# Altium schematic sheet SLAVE_HW.SchDoc
size A4; DocumentNumber: 1; SheetNumber: 1; SheetTotal: 5
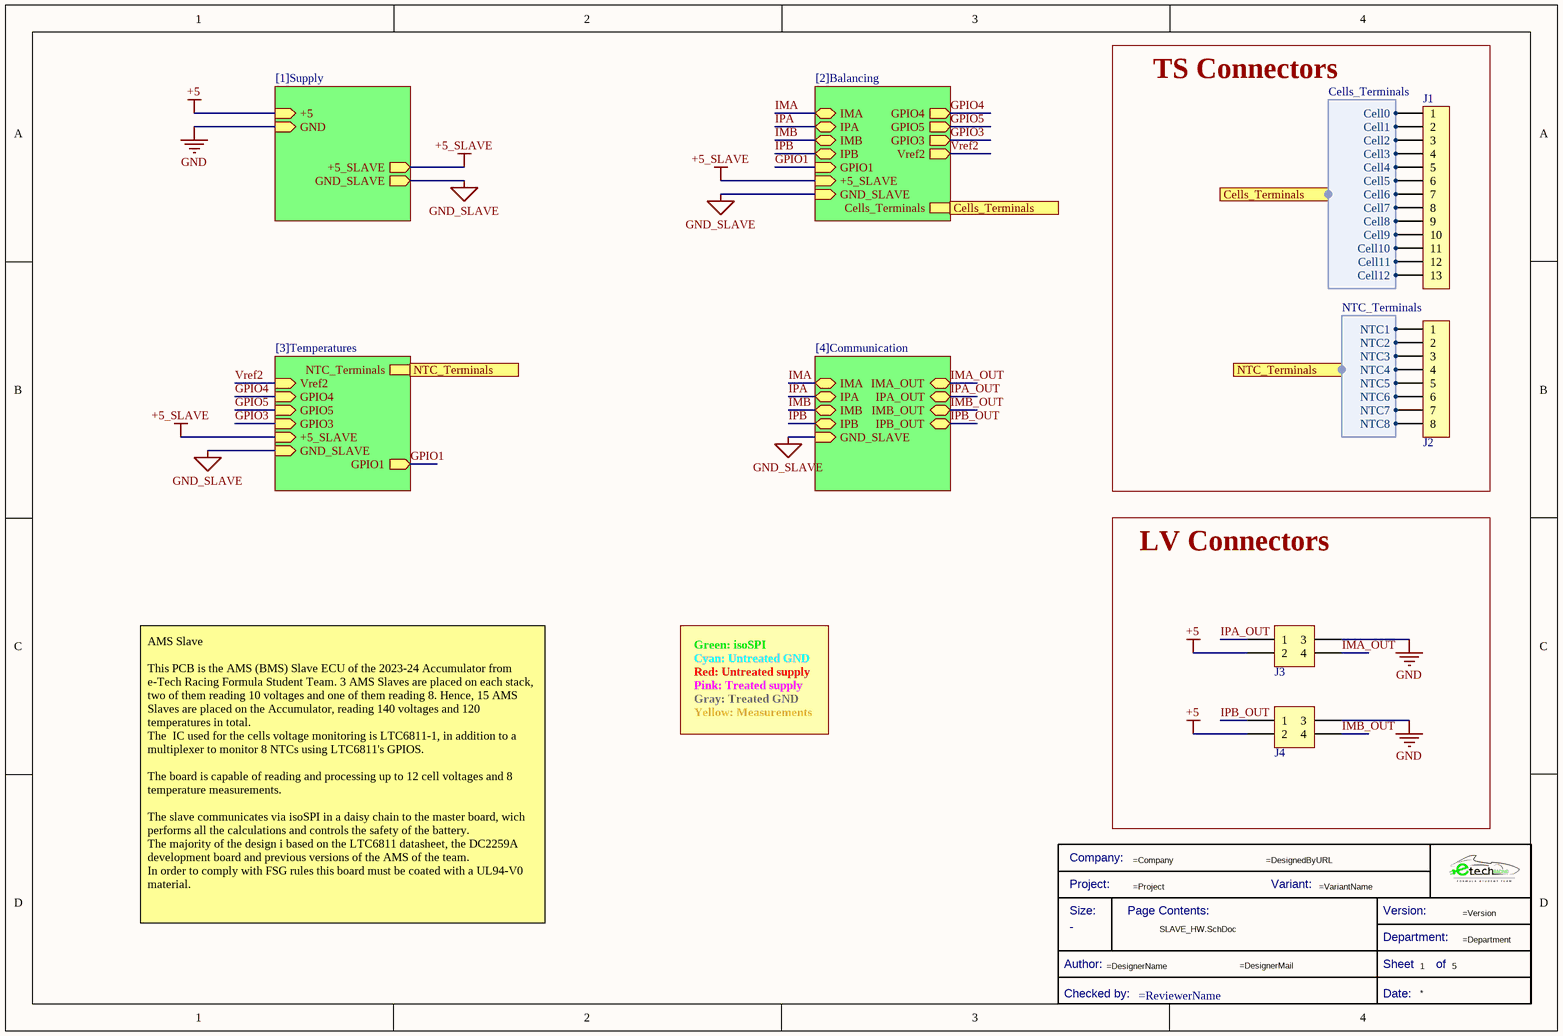
[diagram p0: SLAVE_HW.SchDoc]

## Parts
*  Title Block_template  (value not drawn)  (graphical)
J1  61301311121  [J_Pinheader_1x13]  (value not drawn)
J2  61301211121  [J_Pinheader_1x8]  (value not drawn)
J3  J_NanoFit_2x2  [J_NanoFit_2x2_v]  (value not drawn)
J4  J_NanoFit_2x2  [J_NanoFit_2x2_v]  (value not drawn)

## Blocks framed on the sheet
TS Connectors: J1 J2
LV Connectors: J3 J4

## Sub-sheets
Balancing = [2]Balancing: GPIO4 (out), GPIO5 (out), GPIO1 (in), +5_SLAVE (in), GND_SLAVE (in), IMA (bidir), IPA (bidir), IMB (bidir), IPB (bidir), GPIO3 (out), Vref2 (out), Cells_Terminals (harness Cells_Terminals)
Communication = [4]Communication: IMA_OUT (bidir), IPA_OUT (bidir), IMB_OUT (bidir), IPB_OUT (bidir), IMA (bidir), IPA (bidir), IMB (bidir), IPB (bidir), GND_SLAVE (in)
Supply = [1]Supply: +5 (in), GND (in), +5_SLAVE (out), GND_SLAVE (out)
Temperatures = [3]Temperatures: GPIO4 (in), GPIO5 (in), +5_SLAVE (in), GND_SLAVE (in), GPIO1 (out), GPIO3 (in), Vref2 (in), NTC_Terminals (harness NTC_Terminals)

## Ports
Cells_Terminals (harness Cells_Terminals), NTC_Terminals (harness NTC_Terminals)

## Harnesses
Cells_Terminals: Cell0, Cell1, Cell2, Cell3, Cell4, Cell5, Cell6, Cell7, Cell8, Cell9, Cell10, Cell11, Cell12
NTC_Terminals: NTC1, NTC2, NTC3, NTC4, NTC5, NTC6, NTC7, NTC8

## Nets
+5: J3.2 J4.2 ; sheet Supply/+5
+5_SLAVE: sheet Supply/+5_SLAVE, sheet Balancing/+5_SLAVE, sheet Temperatures/+5_SLAVE
GND: J3.3 J4.3 ; sheet Supply/GND
GND_SLAVE: sheet Supply/GND_SLAVE, sheet Balancing/GND_SLAVE, sheet Temperatures/GND_SLAVE, sheet Communication/GND_SLAVE
GPIO1: sheet Balancing/GPIO1, sheet Temperatures/GPIO1
GPIO3: sheet Balancing/GPIO3, sheet Temperatures/GPIO3
GPIO4: sheet Balancing/GPIO4, sheet Temperatures/GPIO4
GPIO5: sheet Balancing/GPIO5, sheet Temperatures/GPIO5
IMA: sheet Balancing/IMA, sheet Communication/IMA
IMA_OUT: J3.4 ; sheet Communication/IMA_OUT
IMB: sheet Balancing/IMB, sheet Communication/IMB
IMB_OUT: J4.4 ; sheet Communication/IMB_OUT
IPA: sheet Balancing/IPA, sheet Communication/IPA
IPA_OUT: J3.1 ; sheet Communication/IPA_OUT
IPB: sheet Balancing/IPB, sheet Communication/IPB
IPB_OUT: J4.1 ; sheet Communication/IPB_OUT
Vref2: sheet Balancing/Vref2, sheet Temperatures/Vref2
NetJ1_1: J1.1 ; port Cells_Terminals.Cell0
NetJ1_2: J1.2 ; port Cells_Terminals.Cell1
NetJ1_3: J1.3 ; port Cells_Terminals.Cell2
NetJ1_4: J1.4 ; port Cells_Terminals.Cell3
NetJ1_5: J1.5 ; port Cells_Terminals.Cell4
NetJ1_6: J1.6 ; port Cells_Terminals.Cell5
NetJ1_7: J1.7 ; port Cells_Terminals.Cell6
NetJ1_8: J1.8 ; port Cells_Terminals.Cell7
NetJ1_9: J1.9 ; port Cells_Terminals.Cell8
NetJ1_10: J1.10 ; port Cells_Terminals.Cell9
NetJ1_11: J1.11 ; port Cells_Terminals.Cell10
NetJ1_12: J1.12 ; port Cells_Terminals.Cell11
NetJ1_13: J1.13 ; port Cells_Terminals.Cell12
NetJ2_1: J2.1 ; port NTC_Terminals.NTC1
NetJ2_2: J2.2 ; port NTC_Terminals.NTC2
NetJ2_3: J2.3 ; port NTC_Terminals.NTC3
NetJ2_4: J2.4 ; port NTC_Terminals.NTC4
NetJ2_5: J2.5 ; port NTC_Terminals.NTC5
NetJ2_6: J2.6 ; port NTC_Terminals.NTC6
NetJ2_7: J2.7 ; port NTC_Terminals.NTC7
NetJ2_8: J2.8 ; port NTC_Terminals.NTC8

## Buses and harness runs
harness port Cells_Terminals = sheet Balancing/Cells_Terminals
harness port NTC_Terminals = sheet Temperatures/NTC_Terminals

## Notes on the sheet
- Green: isoSPI
- Cyan: Untreated GND
- Red: Untreated supply
- Yellow: Measurements
- Pink: Treated supply
- Gray: Treated GND
- AMS Slave
  This PCB is the AMS (BMS) Slave ECU of the 2023-24 Accumulator from e-Tech Racing Formula Student Team. 3 AMS Slaves are placed on each stack, two of them reading 10 voltages and one of them reading 8. Hence, 15 AMS Slaves are placed on the Accumulator, reading 140 voltages and 120 temperatures in total.                                                                                                                                                                                                                              The  IC used for the cells voltage monitoring is LTC6811-1, in addition to a multiplexer to monitor 8 NTCs using LTC6811's GPIOS.
  The board is capable of reading and processing up to 12 cell voltages and 8 temperature measurements.
  The slave communicates via isoSPI in a daisy chain to the master board, wich performs all the calculations and controls the safety of the battery.                                                                                                                                                  The majority of the design i based on the LTC6811 datasheet, the DC2259A development board and previous versions of the AMS of the team.                                                                                                                                                     In order to comply with FSG rules this board must be coated with a UL94-V0 material.
- (in symbol Title Block_template) Company:; Project:; Variant:; Size:; Page Contents:; Version:; Department:; Author:; Sheet; of; Checked by:; Date:

## Library data of the parts
* = Title Block_template: Standard Title Block; .Creator: GP; Category: Title Block; .PCBcheck: GP; .SCHcheck: GP; Checked by:: =ReviewerName; Size: -
J1 = J_Pinheader_1x13: THT Vertical Pin Header WR-PHD, Pitch 2.54 mm, Single Row, 13 pins; Manufacturer 1: Wurth Electronics; Number of Positions: 12; Gender: Male; Connector Type: Male Pin; Pitch: 0.1inch; Supplier 1: Digi-Key; RoHS: Yes; Category: Connectors; Pricing 1: 1=0,57000, 10=0,48400, 25=0,40400, 50=0,33700, 100=0,30600, 1000=0,27800 (USD); Mount: Through Hole; Contact Plating: Gold; Contact Material: Copper; Color: Black; Number of Rows: 1; Packaging: Bulk; Termination: Solder; Number of Contacts: 12; Contact Mating Length: 0.236inch; REACH SVHC: Unknown; RoHS Compliant: Yes; ComponentLink1URL: http://www.farnell.com/cad/1737268.pdf?src-supplier=Element14; ComponentLink1Description: http://www.farnell.com/cad/1737268.pdf?src-supplier=Element14; ComponentLink2URL: https://katalog.we-online.de/em/datasheet/6130xx11121.pdf?src-supplier=Digi-Key; ComponentLink2Description: https://katalog.we-online.de/em/datasheet/6130xx11121.pdf?src-supplier=Digi-Key; Supplier 2: Rs; Manufacturer: Wurth Electronics; Manufacturer Part Number: 61301311121; Stock 2: 90; Pricing 2: 5=0,69, 100=0,358, 375=0,34, 1500=0,324, 3000=0,306 (EUR); Mounting Technology: Through Hole; Series: WR-PHD; Contact Type: Male Pin; Reach SVHC Compliant: Unknown; Lead Free: Lead Free
J2 = J_Pinheader_1x8: THT Vertical Pin Header WR-PHD, Pitch 2.54 mm, Single Row, 12 pins; Manufacturer 1: Wurth Electronics; Number of Positions: 12; Gender: Male; Connector Type: Male Pin; Pitch: 0.1inch; Supplier 1: Digi-Key; Manufacturer Part Number 1: 61301211121; RoHS: Yes; Category: Connectors; Stock 1: 2124; Pricing 1: 1=0,57000, 10=0,48400, 25=0,40400, 50=0,33700, 100=0,30600, 1000=0,27800 (USD); Mount: Through Hole; Contact Plating: Gold; Contact Material: Copper; Color: Black; Number of Rows: 1; Packaging: Bulk; Termination: Solder; Number of Contacts: 12; Contact Mating Length: 0.236inch; REACH SVHC: Unknown; RoHS Compliant: Yes; ComponentLink1URL: http://www.farnell.com/cad/1737268.pdf?src-supplier=Element14; ComponentLink1Description: http://www.farnell.com/cad/1737268.pdf?src-supplier=Element14; ComponentLink2URL: https://katalog.we-online.de/em/datasheet/6130xx11121.pdf?src-supplier=Digi-Key; ComponentLink2Description: https://katalog.we-online.de/em/datasheet/6130xx11121.pdf?src-supplier=Digi-Key
J3 J4 = J_NanoFit_2x2: Conn Nano-Fit Power HDR 4 POS 2.5mm Solder ST Through Hole 4 Terminal Single Port Tray; Manufacturer 1: Molex; Manufacturer Part Number 1: 1053101104; Supplier 1: Farnell; RoHS: Yes; Category: Uncategorized; Stock 1: 255; Pricing 1: 1=1,43000, 10=1,18000, 50=0,74900, 100=0,72900, 500=0,71400, 1000=0,70700 (EUR); ComponentLink1URL: https://www.molex.com/pdm_docs/ps/PS-105300-100-001.pdf?src-supplier=Digi-Key; ComponentLink1Description: https://www.molex.com/pdm_docs/ps/PS-105300-100-001.pdf?src-supplier=Digi-Key; Supplier Part Number 1: 2820681